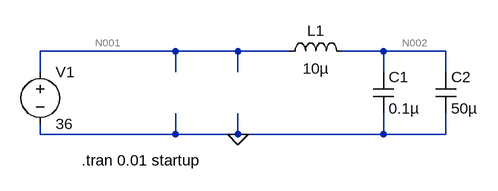
[diagram p0: schematic PowerInput.asc]
PowerInput.asc, the LTspice schematic file:
Version 4
SHEET 1 880 680
WIRE -144 96 -352 96
WIRE -48 96 -144 96
WIRE 32 96 -48 96
WIRE 176 96 112 96
WIRE 272 96 176 96
WIRE -352 128 -352 96
WIRE -144 128 -144 96
WIRE -48 128 -48 96
WIRE 176 128 176 96
WIRE 272 128 272 96
WIRE -352 224 -352 208
WIRE -144 224 -144 192
WIRE -144 224 -352 224
WIRE -48 224 -48 192
WIRE -48 224 -144 224
WIRE 176 224 176 192
WIRE 176 224 -48 224
WIRE 272 224 272 192
WIRE 272 224 176 224
FLAG -48 224 0
SYMBOL cap 160 128 R0
SYMATTR InstName C1
SYMATTR Value 0.1µ
SYMBOL cap 256 128 R0
SYMATTR InstName C2
SYMATTR Value 50µ
SYMBOL ind 16 112 R270
WINDOW 0 32 56 VTop 2
WINDOW 3 5 56 VBottom 2
SYMATTR InstName L1
SYMATTR Value 10µ
SYMATTR SpiceLine Rser=7
SYMBOL voltage -352 112 R0
WINDOW 123 0 0 Left 2
WINDOW 39 0 0 Left 2
SYMATTR InstName V1
SYMATTR Value 36
TEXT -288 264 Left 2 !.tran 0.01 startup

The netlist it stands for:
* PowerInput.asc
C1 N002 0 0.1µ
C2 N002 0 50µ
L1 N001 N002 10µ Rser=7
V1 N001 0 36
.tran 0.01 startup
.backanno
.end

* Results of the author's LTspice run, read from the files saved beside the schematic
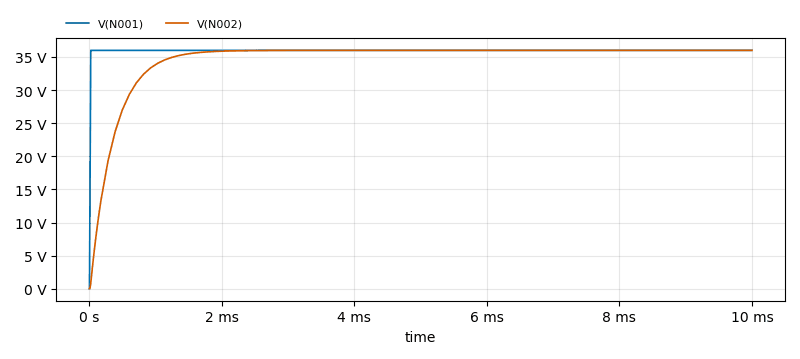
[diagram p1: Transient Analysis of PowerInput.asc, plotted from the saved traces]
* Transient Analysis, 1 run:
*   V(N001): min 0 V, max 36 V, average 35.96 V, rms 35.98 V, last 36 V
*   V(N002): min 0 V, max 36 V, average 34.69 V, rms 35.02 V, last 36 V